# EAGLE design CCR4 (EAGLE 7.6.0)
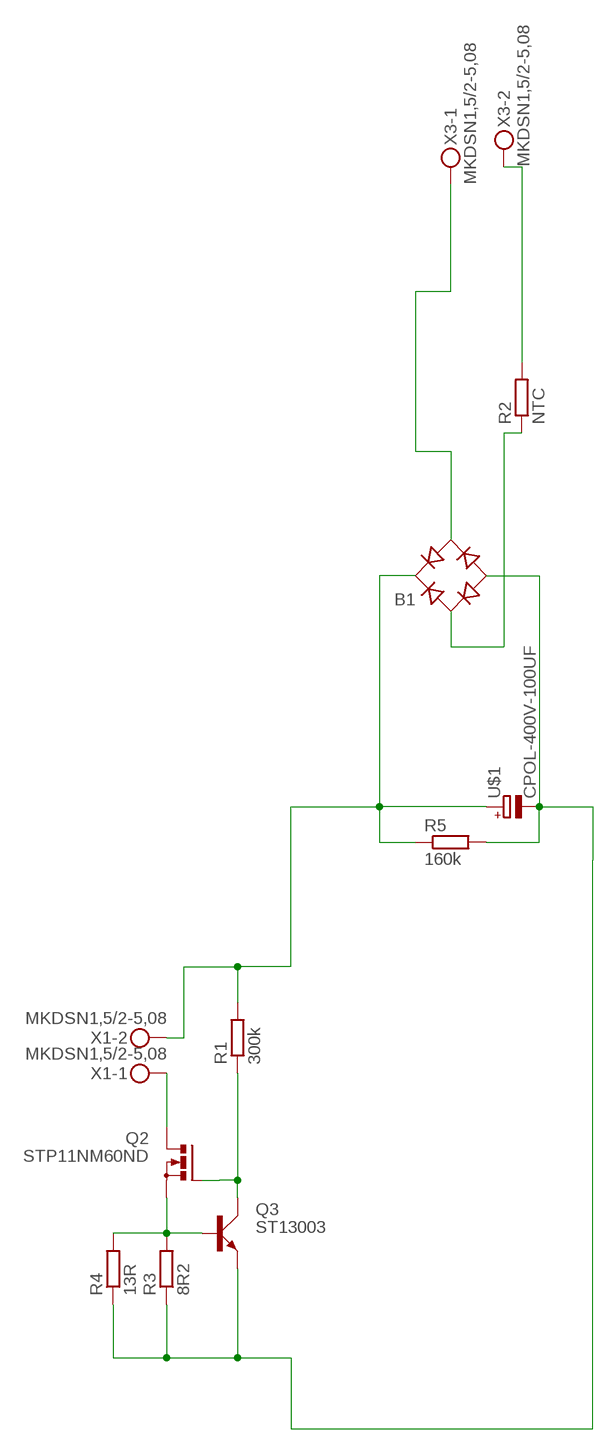
[diagram p0: schematic, sheet 1]

## Parts
B1  RB1A  [RB1A]
Q2  STP11NM60ND  BUZ11BV  [TO220BV]
Q3  ST13003  KSP42TA  [SOT-92WIDE]
R1  300k  R-EU_0411/12  [0411/12]
R2  NTC  R-EU_0309/10  [0309/10]
R3  8R2  R-EU_0411/12  [0411/12]
R4  13R  R-EU_0411/12  [0411/12]
R5  160k  R-EU_0204/7  [0204/7]
U$1  CPOL-400V-100UF  [18*36.5_7.62]
X1  MKDSN1,5/2-5,08  [MKDSN1,5/2-5,08]
X3  MKDSN1,5/2-5,08  [MKDSN1,5/2-5,08]

## Nets
N$1: B1.+ R1.2 R5.1 U$1.P$2(+) X1.2
N$2: B1.AC1 R2.1
N$3: R2.2 X3.2
N$4: B1.AC2 X3.1
N$5: Q2.D X1.1
N$6: Q2.S Q3.B R3.2 R4.2
N$7: Q2.G Q3.C R1.1
N$9: B1.- Q3.E R3.1 R4.1 R5.2 U$1.P$1(-)

## Library data of the parts
B1 = rectifier:RB1A: RECTIFIER 1 A
Q2 = transistor-power:BUZ11: N-CHANNEL MOS FET
Q3 = Namenlos:KSP42TA
R1-R5 = rcl:R-EU_: RESISTOR, European symbol
U$1 = Namenlos:CPOL-400V-100UF
X1 X3 = con-phoenix-508:MKDSN1,5/2-5,08: MKDSN 1,5/ 2-5,08 Printklemme Nennstrom: 13,5 A Nennspannung: 250 V Rastermaß: 5,08 mm Polzahl: 2 Anschlussart: Schraubanschluss Montage: Löten Anschlussrichtung Leiter/Platine: 0 ° Artikelnummer: 1729128 Source: http://eshop.phoenixcontact.com .. 1729128.pdf

## Board
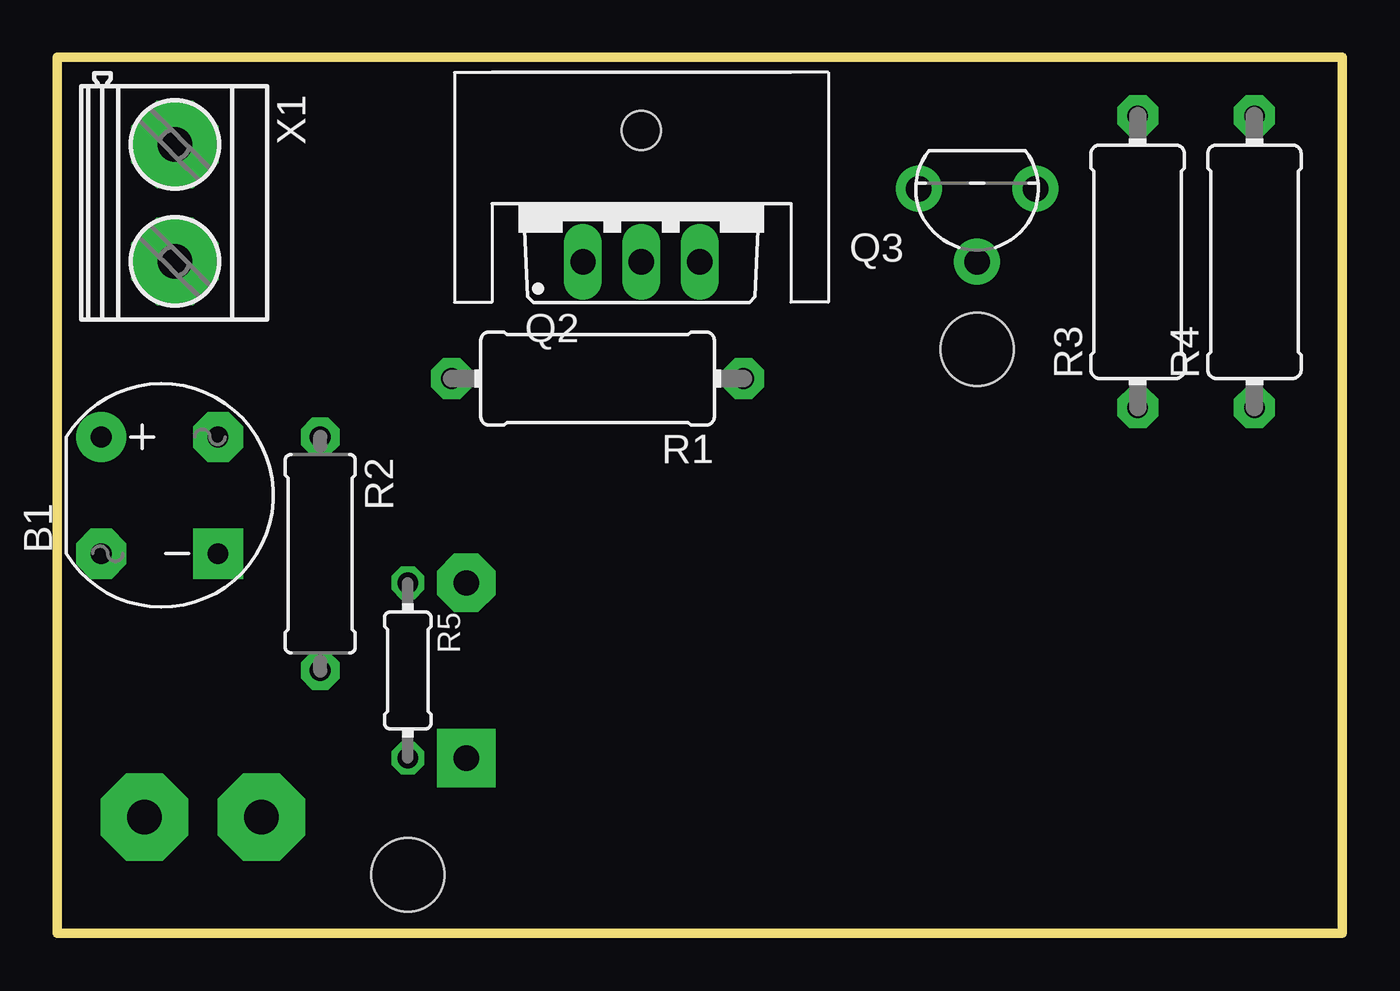
[diagram p1: board, top side]
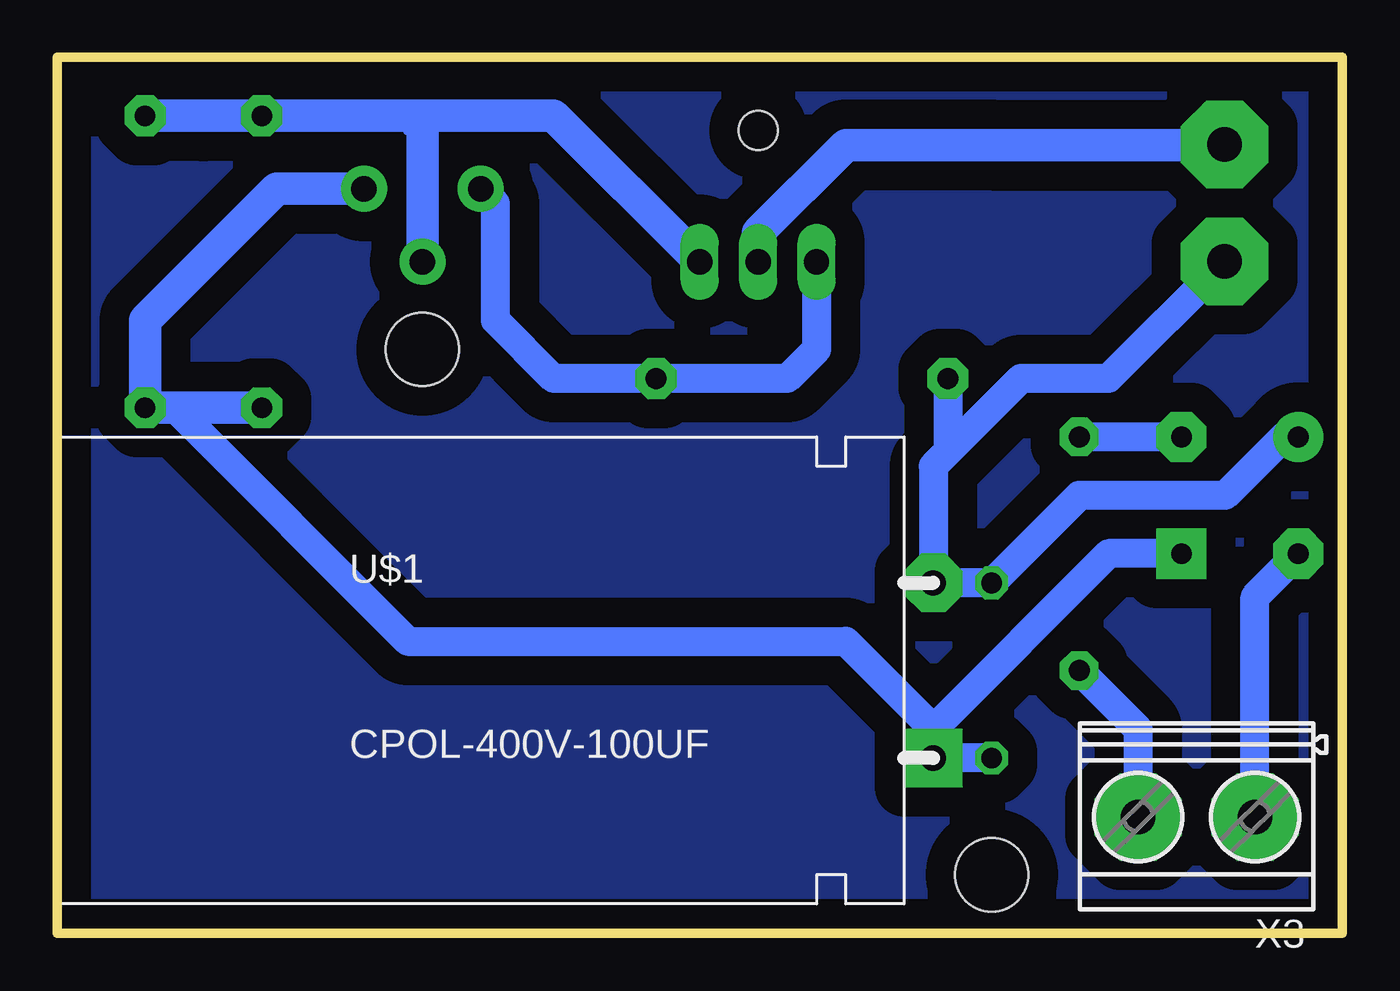
[diagram p2: board, bottom side, seen from below]

Size 55.88 x 38.1 mm. Coordinates in mm from the lower left corner, seen from the top.
Outline: 0,38.1 0,0 55.88,0 55.88,38.1 0,38.1
Copper layers (1*16): Top 0.035mm / dielectric 1.5mm / Bottom 0.035mm
Design rules "default": minimum track width 10mil, minimum drill 24mil, track to track 8mil, track to pad 8mil, pad to pad 8mil, via to via 8mil, smd to smd 8mil, copper to edge 40mil, drill to drill 8mil, minimum pad ring 10mil, minimum via ring 8mil, stop-mask expansion 4mil, vias tented up to drill 0mil, thermal gap 10mil
Holes 3.2 mm at 40.01,25.4 15.24,2.54

### Footprints (pad centres in the part's own frame; a part is rotated, then mirrored left to right if it is on the bottom)
RB1A = drill 0.9 pad 2.184: + -2.54,2.54 | drill 0.9 pad 2.184 square: - 2.54,-2.54 | drill 0.9 pad 2.184 octagon: AC1 2.54,2.54; AC2 -2.54,-2.54
TO220BV = drill 1.1 pad 1.422 long: D 0,-2.54; G -2.54,-2.54; S 2.54,-2.54
SOT-92WIDE = drill 1.1 pad 2: B 0,2.54; C 2.54,-0.635; E -2.54,-0.635
0411/12 = drill 0.9 pad 1.778 octagon: 1 -6.35,0; 2 6.35,0
0309/10 = drill 0.9 pad 1.676 octagon: 1 -5.08,0; 2 5.08,0
0204/7 = drill 0.9 pad 1.422 octagon: 1 -3.81,0; 2 3.81,0
18*36.5_7.62 = drill 1.1 pad 2.54 square: P$1 0,-3.81 | drill 1.1 pad 2.54 octagon: P$2 0,3.81
SK95-3M3_HOLE = hole 1.7: 0,3.175
MKDSN1,5/2-5,08 = drill 1.5 pad 3.81 octagon: 1 -2.561,0.025; 2 2.519,0.025

### Placement (x,y rotation side)
B1  4.45,19.05 0 top
Q2  25.4,31.75 0 top
Q3  40.01,31.75 180 top
R1  23.5,24.13 180 top
R2  11.43,16.51 270 top
R3  46.99,29.21 90 top
R4  52.07,29.21 90 top
R5  15.24,11.43 270 top
U$1  17.78,11.43 0 bottom
U$2  [SK95-3M3_HOLE]  25.4,31.75 0 top
X1  5.08,31.75 270 top
X3  6.35,5.08 180 bottom

### Tracks (layer width: path | path; a pad name or v marks a point on that pad's centre or on a via)
N$1
  Bottom 0.406: X1.2 5.11,29.18
  Bottom 1.27: B1.+ 2.54,21.59 5.08,19.05 11.43,19.05 R5.1 U$1.P$2 17.78,20.32 17.15,20.95 | 5.11,29.18 10.16,24.13 13.97,24.13 17.15,20.95 | R1.2 17.15,20.95
N$2
  Bottom 0.406: R2.1
  Bottom 1.27: B1.AC1 R2.1
N$3
  Bottom 1.27: X3.2 8.87,8.87 R2.2
N$4
  Bottom 1.27: X3.1 3.79,14.63 B1.AC2
N$5
  Bottom 1.422: X1.1 5.13,34.29 15.24,34.29 20.32,34.29 21.59,34.29 25.4,30.48 Q2.D
N$6
  Bottom 0.406: 40.01,34.92 40.64,34.92 40.64,35.56
  Bottom 1.422: R4.2 49.53,35.56 R3.2 43.18,35.56 40.64,35.56 38.1,35.56 34.29,35.56 Q2.S | Q3.B 40.01,34.92
N$7
  Bottom 1.27: Q2.G 22.86,25.4 24.13,24.13 R1.1 34.29,24.13 36.83,26.67 36.83,31.75 Q3.C
N$9
  Bottom 1.27: B1.- 10.16,16.51 17.78,8.89 | 17.78,8.89 U$1.P$1 R5.2 | 50.8,22.86 40.64,12.7 21.59,12.7 17.78,8.89
  Bottom 1.422: Q3.E 46.36,32.38 52.07,26.67 R4.1 50.8,22.86 R3.1
N$133
  pour Bottom (isolate 1.27): 0,38.1 54.61,38.1 55.88,0 0,0